# EAGLE schematic mc_board (EAGLE 7.5.0)
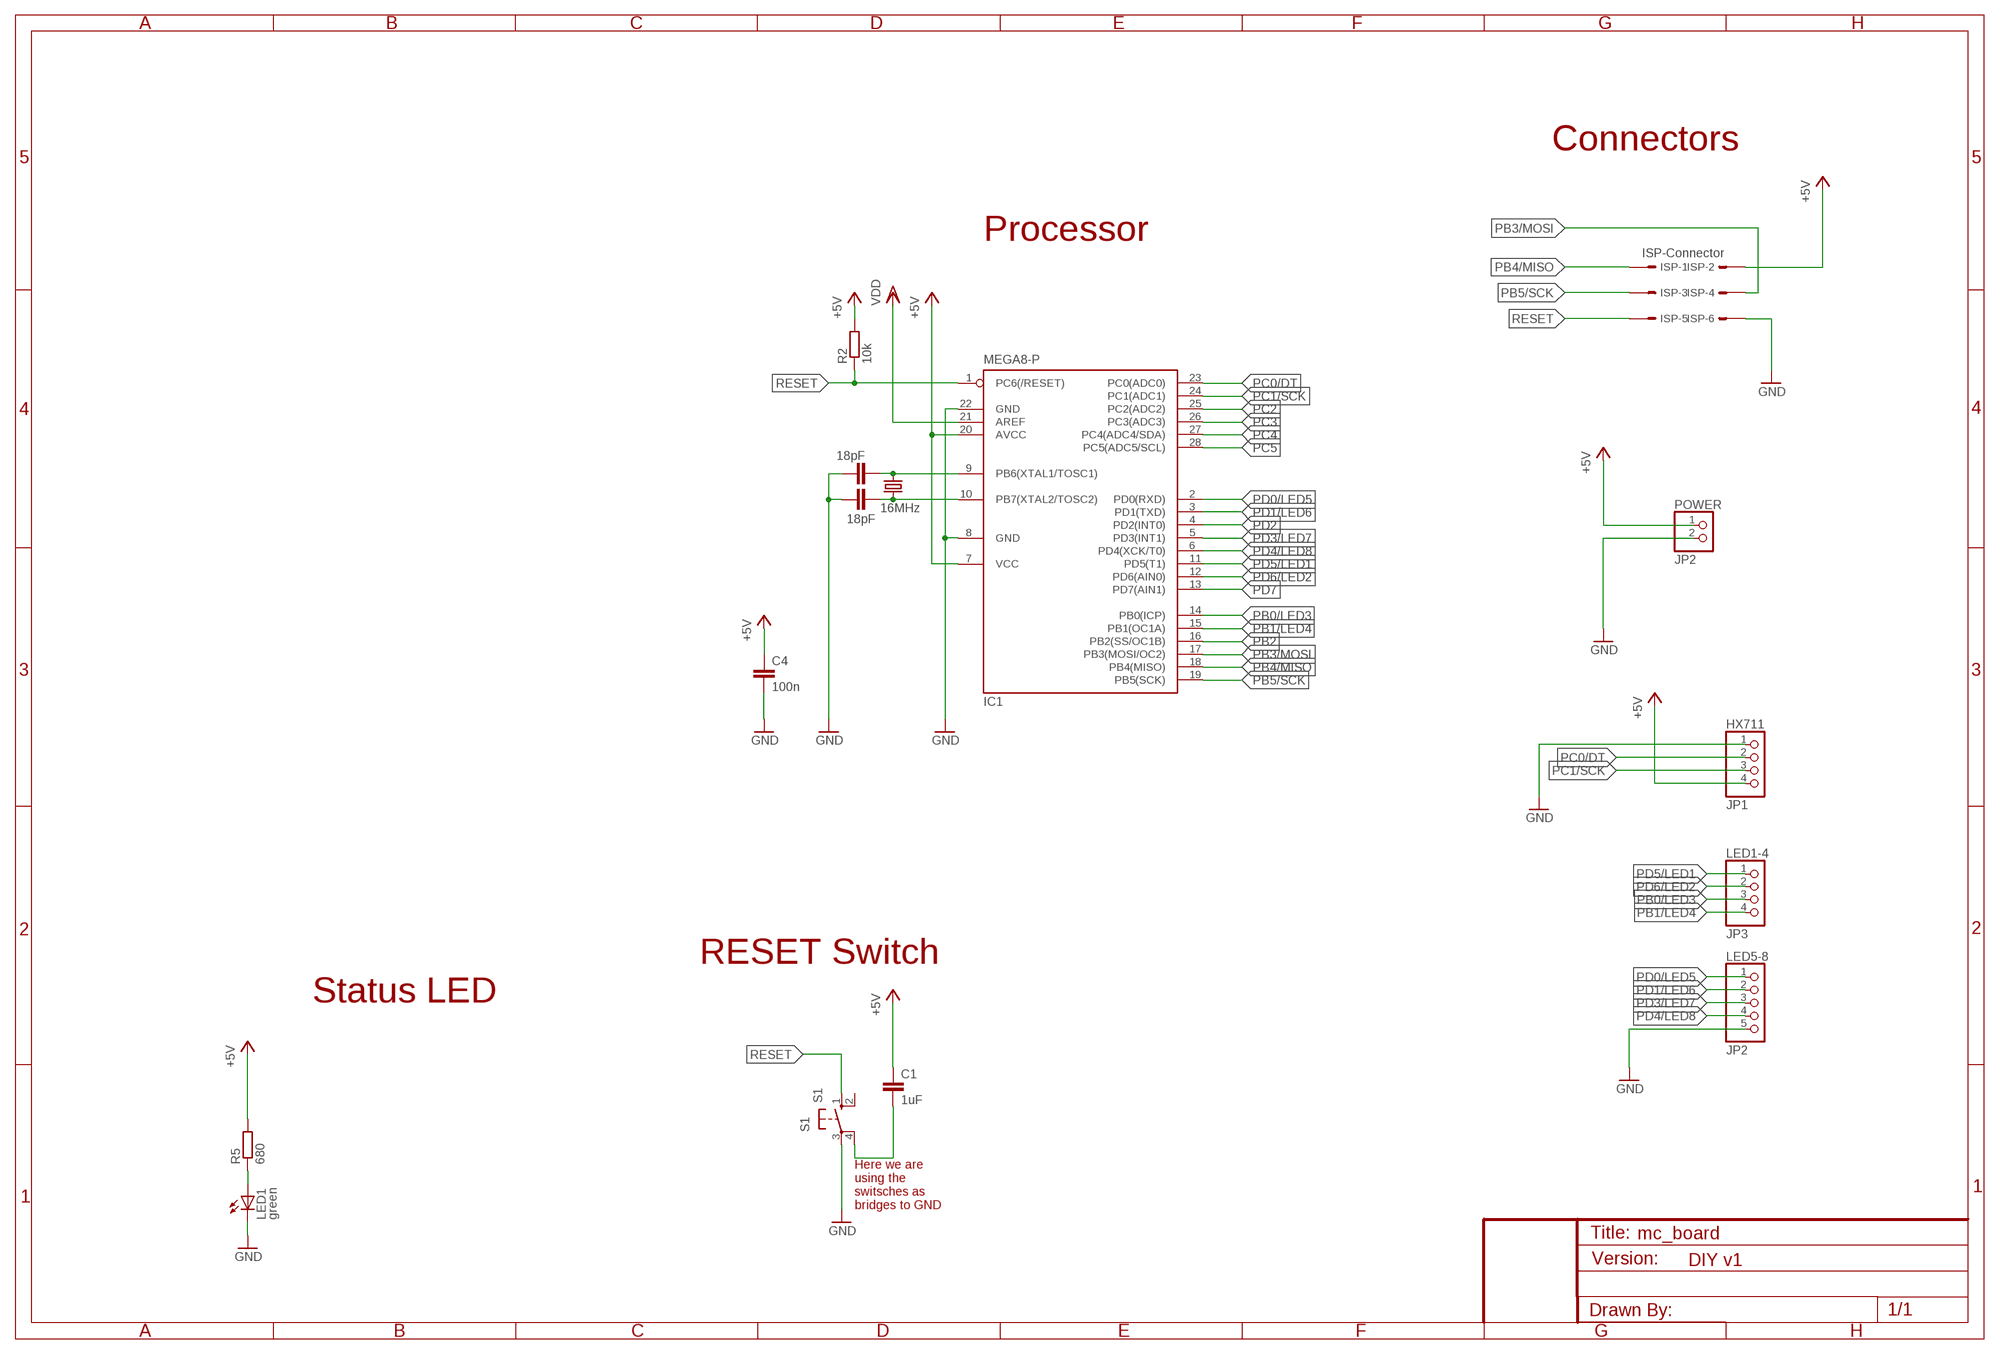
[diagram p0: schematic, sheet 1]

## Parts
C1  1uF  C-EUC0805  [C0805]
C2  18pF  C-EUC0805K  [C0805K]
C3  18pF  C-EUC0805K  [C0805K]
C4  100n  C-EUC0805  [C0805]
HX711  JP1  PINHD-1X4  [1X04]
IC1  MEGA8-P  [DIL28-3]
ISP  ISP-Connector  057-006-1  [057-006-1]
LED1  green  LEDCHIPLED_0805  [CHIPLED_0805]
LED1-4  JP3  PINHD-1X4  [1X04]
LED5-8  JP2  PINHD-1X5  [1X05]
POWER  JP2  PINHD-1X2  [1X02]
Q1  16MHz  CRYSTALHC49S  [HC49/S]
R2  10k  R-EU_R1206  [R1206]
R5  680  R-EU_R0805  [R0805]
S1  S1  10-XX  [B3F-10XX]

## Nets
+5V: C1.1 C4.1 HX711.4 IC1.7(VCC) IC1.20(AVCC) ISP.2 POWER.1 R2.2 R5.2
GND: C2.2 C3.2 C4.2 HX711.1 IC1.8(GND) IC1.22(GND) ISP.6 LED1.C LED5-8.5 POWER.2 S1.3(P)
N$4: LED1.A R5.1
N$5: C3.1 IC1.9(PB6(XTAL1/TOSC1)) Q1.1
N$6: C2.1 IC1.10(PB7(XTAL2/TOSC2)) Q1.2
N$9: C1.2 S1.4(P1)
PB0/LED3: IC1.14(PB0(ICP)) LED1-4.3
PB1/LED4: IC1.15(PB1(OC1A)) LED1-4.4
PB2: IC1.16(PB2(SS/OC1B))
PB3/MOSI: IC1.17(PB3(MOSI/OC2)) ISP.4
PB4/MISO: IC1.18(PB4(MISO)) ISP.1
PB5/SCK: IC1.19(PB5(SCK)) ISP.3
PC0/DT: HX711.2 IC1.23(PC0(ADC0))
PC1/SCK: HX711.3 IC1.24(PC1(ADC1))
PC2: IC1.25(PC2(ADC2))
PC3: IC1.26(PC3(ADC3))
PC4: IC1.27(PC4(ADC4/SDA))
PC5: IC1.28(PC5(ADC5/SCL))
PD0/LED5: IC1.2(PD0(RXD)) LED5-8.1
PD1/LED6: IC1.3(PD1(TXD)) LED5-8.2
PD2: IC1.4(PD2(INT0))
PD3/LED7: IC1.5(PD3(INT1)) LED5-8.3
PD4/LED8: IC1.6(PD4(XCK/T0)) LED5-8.4
PD5/LED1: IC1.11(PD5(T1)) LED1-4.1
PD6/LED2: IC1.12(PD6(AIN0)) LED1-4.2
PD7: IC1.13(PD7(AIN1))
RESET: IC1.1(PC6(/RESET)) ISP.5 R2.1 S1.1(S)
VDD: IC1.21(AREF)
Unconnected: S1.2(S1)

## Notes on the sheet
- Connectors
- Processor
- RESET Switch
- Status LED
- Here we are
  using the 
  switsches as
  bridges to GND
- DIY v1

## Library data of the parts
C1 C4 = rcl-2:C-EU: CAPACITOR, European symbol
C2 C3 = resistor:C-EU: CAPACITOR, European symbol
HX711 LED1-4 = pinhead:PINHD-1X4: PIN HEADER
IC1 = atmel:MEGA8-P: MICROCONTROLLER 8 Kbytes FLASH, 1 kbytes SRAM, 512 bytes EEPROM, USART, 4-channel 10 bit ADC, 2-channel 8 bit ADC Pin compatible with Atmega48, ATMega88, ATMega168 Source: avr.lbr; OC_FARNELL: unknown; OC_NEWARK: unknown
ISP = con-panduit:057-006-: CONNECTOR 6-pin series 057 contact pc board low profile headers; OC_FARNELL: unknown; OC_NEWARK: unknown
LED1 = led:LED: LED OSRAM: - CHIPLED LG R971, LG N971, LY N971, LG Q971, LY Q971, LO R971, LY R971 LH N974, LH R974 LS Q976, LO Q976, LY Q976 LO Q996 - Hyper CHIPLED LW Q18S LB Q993, LB Q99A, LB R99A - SideLED LS A670, LO A670, LY A670, LG A670, LP A670 LB A673, LV A673, LT A673, LW A673 LH A674 LY A675 LS A676, LA A676, LO A676, LY A676, LW A676 LS A679, LY A679, LG A679 - Hyper Micro SIDELED® LS Y876, LA Y876, LO Y876, LY Y876 LT Y87S - SmartLED LW L88C, LW L88S LB L89C, LB L89S, LG L890 LS L89K, LO L89K, LY L89K LS L896, LA L896, LO L896, LY L896 - TOPLED LS T670, LO T670, LY T670, LG T670, LP T670 LSG T670, LSP T670, LSY T670, LOP T670, LYG T670 LG T671, LOG T671, LSG T671 LB T673, LV T673, LT T673, LW T673 LH T674 LS T676, LA T676, LO T676, LY T676, LB T676, LH T676, LSB T676, LW T676 LB T67C, LV T67C, LT T67C, LS T67K, LO T67K, LY T67K, LW E67C LS E67B, LA E67B, LO E67B, LY E67B, LB E67C, LV E67C, LT E67C LW T67C LS T679, LY T679, LG T679 LS T770, LO T770, LY T770, LG T770, LP T770 LB T773, LV T773, LT T773, LW T773 LH T774 LS E675, LA E675, LY E675, LS T675 LS T776, LA T776, LO T776, LY T776, LB T776 LHGB T686 LT T68C, LB T68C - Hyper Mini TOPLED® LB M676 - Mini TOPLED Santana® LG M470 LS M47K, LO M47K, LY M47K Source: http://www.osram.convergy.de LUXEON: - LUMILED® LXK2-PW12-R00, LXK2-PW12-S00, LXK2-PW14-U00, LXK2-PW14-V00 LXK2-PM12-R00, LXK2-PM12-S00, LXK2-PM14-U00 LXK2-PE12-Q00, LXK2-PE12-R00, LXK2-PE12-S00, LXK2-PE14-T00, LXK2-PE14-U00 LXK2-PB12-K00, LXK2-PB12-L00, LXK2-PB12-M00, LXK2-PB14-N00, LXK2-PB14-P00, LXK2-PB14-Q00 LXK2-PR12-L00, LXK2-PR12-M00, LXK2-PR14-Q00, LXK2-PR14-R00 LXK2-PD12-Q00, LXK2-PD12-R00, LXK2-PD12-S00 LXK2-PH12-R00, LXK2-PH12-S00 LXK2-PL12-P00, LXK2-PL12-Q00, LXK2-PL12-R00 Source: www.luxeon.com KINGBRIGHT: KA-3528ASYC Source: www.kingbright.com
LED5-8 = pinhead:PINHD-1X5: PIN HEADER
POWER = pinhead:PINHD-1X2: PIN HEADER
Q1 = crystal:CRYSTAL: CRYSTAL; OC_FARNELL: 1667008; OC_NEWARK: unknown
R2 R5 = rcl-2:R-EU_: RESISTOR, European symbol
S1 = switch-omron:10-XX: OMRON SWITCH; MPN: B3F-1000; OC_FARNELL: 176432; OC_NEWARK: 36M3542